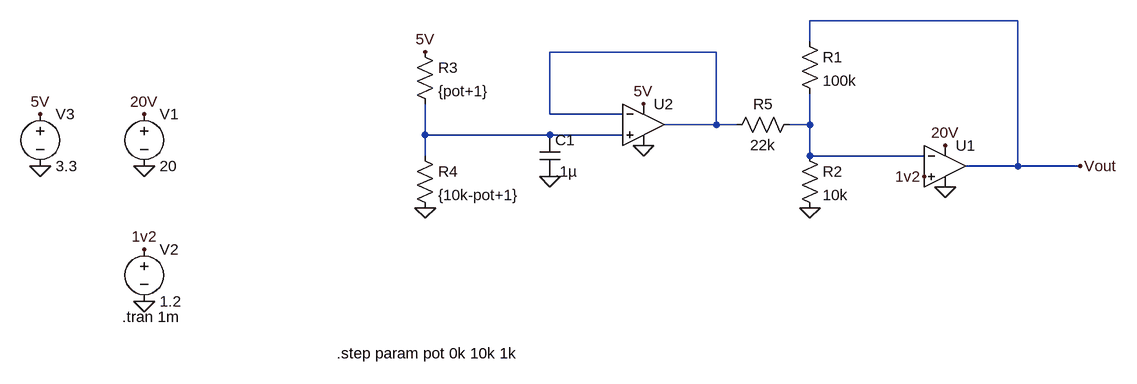
[diagram p0: schematic DCDC_Feedback_Adjustable.asc]
DCDC_Feedback_Adjustable.asc, the LTspice schematic file:
Version 4
SHEET 1 1288 680
WIRE 1008 -16 688 -16
WIRE 688 16 688 -16
WIRE 544 32 288 32
WIRE 288 128 288 32
WIRE 400 128 288 128
WIRE 544 144 544 32
WIRE 544 144 464 144
WIRE 576 144 544 144
WIRE 688 144 688 96
WIRE 688 144 656 144
WIRE 96 160 96 112
WIRE 288 160 96 160
WIRE 400 160 288 160
WIRE 96 192 96 160
WIRE 688 192 688 144
WIRE 864 192 688 192
WIRE 1008 208 1008 -16
WIRE 1008 208 928 208
WIRE 1104 208 1008 208
FLAG -336 208 0
FLAG 896 240 0
FLAG -336 128 20V
FLAG 896 176 20V
FLAG -336 416 0
FLAG -336 336 1v2
FLAG 864 224 1v2
FLAG 688 272 0
FLAG 432 176 0
FLAG -496 208 0
FLAG -496 128 5V
FLAG 432 112 5V
FLAG 96 272 0
FLAG 96 32 5V
FLAG 1104 208 Vout
FLAG 288 224 0
SYMBOL Opamps\\UniversalOpamp2 896 208 R0
SYMATTR InstName U1
SYMBOL voltage -336 112 R0
WINDOW 123 0 0 Left 0
WINDOW 39 0 0 Left 0
SYMATTR InstName V1
SYMATTR Value 20
SYMBOL voltage -336 320 R0
WINDOW 123 0 0 Left 0
WINDOW 39 0 0 Left 0
SYMATTR InstName V2
SYMATTR Value 1.2
SYMBOL res 672 0 R0
SYMATTR InstName R1
SYMATTR Value 100k
SYMBOL res 672 176 R0
SYMATTR InstName R2
SYMATTR Value 10k
SYMBOL Opamps\\UniversalOpamp2 432 144 R0
SYMATTR InstName U2
SYMBOL voltage -496 112 R0
WINDOW 123 0 0 Left 0
WINDOW 39 0 0 Left 0
SYMATTR InstName V3
SYMATTR Value 3.3
SYMBOL res 80 16 R0
SYMATTR InstName R3
SYMATTR Value {pot+1}
SYMBOL res 80 176 R0
SYMATTR InstName R4
SYMATTR Value {10k-pot+1}
SYMBOL res 672 128 R90
WINDOW 0 0 56 VBottom 2
WINDOW 3 32 56 VTop 2
SYMATTR InstName R5
SYMATTR Value 22k
SYMBOL cap 272 160 R0
SYMATTR InstName C1
SYMATTR Value .1µ
TEXT -370 440 Left 2 !.tran 1m
TEXT -40 496 Left 2 !.step param pot 0k 10k 1k

The netlist it stands for:
* DCDC_Feedback_Adjustable.asc
XU1 1v2 N002 20V 0 Vout level.2 Avol=1Meg GBW=10Meg Slew=10Meg ilimit=25m rail=0 Vos=0 phimargin=45 en=0 enk=0 in=0 ink=0 Rin=500Meg  ; pins IN+ IN- V+ V- OUT
V1 20V 0 20
V2 1v2 0 1.2
R1 Vout N002 100k
R2 N002 0 10k
XU2 N003 N001 5V 0 N001 level.2 Avol=1Meg GBW=10Meg Slew=10Meg ilimit=25m rail=0 Vos=0 phimargin=45 en=0 enk=0 in=0 ink=0 Rin=500Meg  ; pins IN+ IN- V+ V- OUT
V3 5V 0 3.3
R3 5V N003 {pot+1}
R4 N003 0 {10k-pot+1}
R5 N002 N001 22k
C1 N003 0 .1µ
.tran 1m
.step param pot 0k 10k 1k
.lib UniversalOpamps2.sub
.backanno
.end